# Altium schematic sheet [5]-Keyboard.SchDoc
size A4
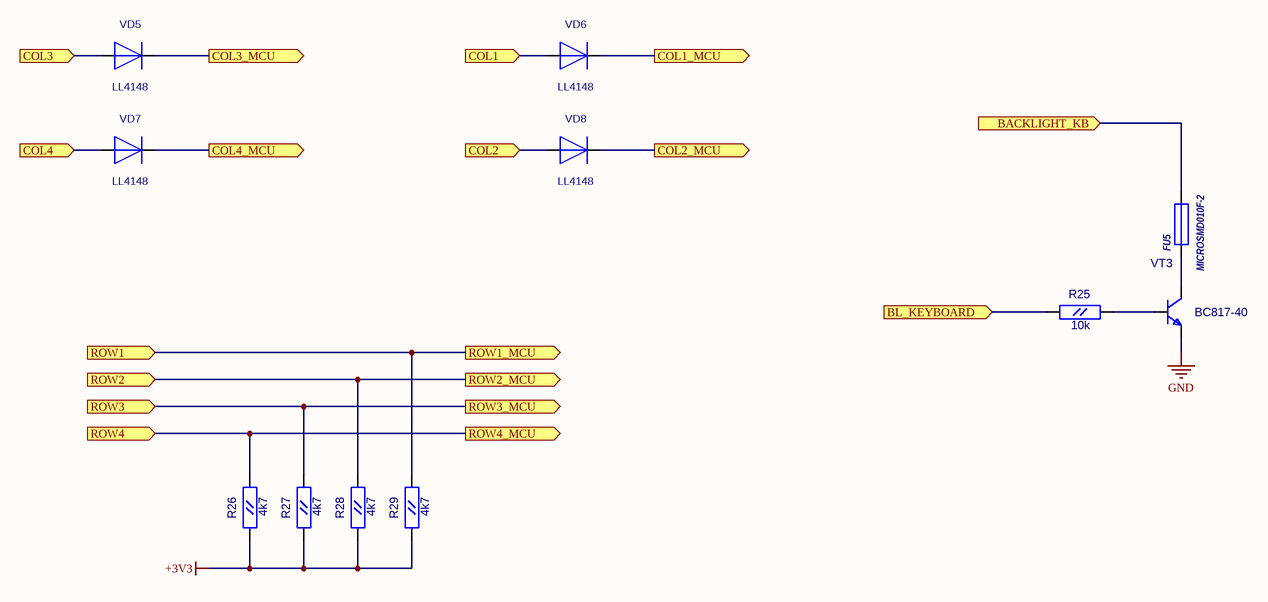
[diagram p0: [5]-Keyboard.SchDoc]

## Parts
FU5  MICROSMD010F-2  [RC1210]
R25  10k  [RC0603]
R26  4k7  [RC0603]
R27  4k7  [RC0603]
R28  4k7  [RC0603]
R29  4k7  [RC0603]
VD5  LL4148  [SOD-80]
VD6  LL4148  [SOD-80]
VD7  LL4148  [SOD-80]
VD8  LL4148  [SOD-80]
VT3  BC817-40  [SOT-23(123)]

## Ports
BACKLIGHT_KB (in), BL_KEYBOARD (in), COL1 (in), COL1_MCU (out), COL2 (in), COL2_MCU (out), COL3 (in), COL3_MCU (out), COL4 (in), COL4_MCU (out), ROW1 (in), ROW1_MCU (out), ROW2 (in), ROW2_MCU (out), ROW3 (in), ROW3_MCU (out), ROW4 (in), ROW4_MCU (out)

## Nets
+3V3: R26.1(A) R27.1(A) R28.1(A) R29.1(A)
GND: VT3.2(E)
BACKLIGHT_KB: FU5.2 ; port BACKLIGHT_KB
BL_KEYBOARD: R25.1(A) ; port BL_KEYBOARD
COL1: VD6.1(-) ; port COL1
COL1_MCU: VD6.2(+) ; port COL1_MCU
COL2: VD8.1(-) ; port COL2
COL2_MCU: VD8.2(+) ; port COL2_MCU
COL3: VD5.1(-) ; port COL3
COL3_MCU: VD5.2(+) ; port COL3_MCU
COL4: VD7.1(-) ; port COL4
COL4_MCU: VD7.2(+) ; port COL4_MCU
ROW1: R29.2(B) ; port ROW1_MCU, port ROW1
ROW2: R28.2(B) ; port ROW2_MCU, port ROW2
ROW3: R27.2(B) ; port ROW3_MCU, port ROW3
ROW4: R26.2(B) ; port ROW4_MCU, port ROW4
NetFU5_1: FU5.1 VT3.3(C)
NetR25_2: R25.2(B) VT3.1(B)

## Library data of the parts
FU5 = MICROSMD: Value: MICROSMD010F-2
R25-R29 = RC0603
  R25: Value: 10k
  R26-R29: Value: 4k7
VT3 = BC846BLT1: NPN 500ma transistor; ComponentField7: Published 29-Sep-2000; OriginalName: BC846BLT1; Value: BC817-40
VD5-VD8 = LL4148: Value: *